# Altium schematic sheet EthernetMagJack.SchDoc
size A
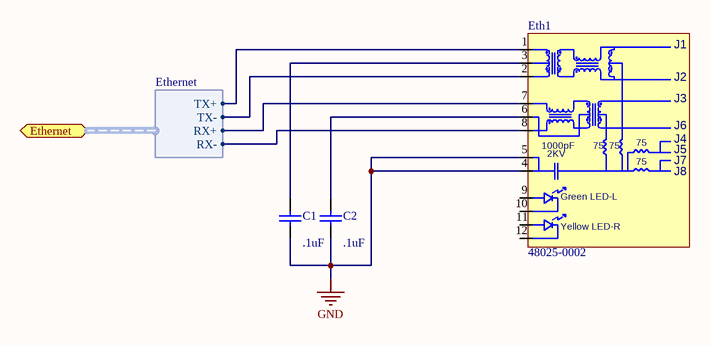
[diagram p0: EthernetMagJack.SchDoc]

## Parts
C1  value .1uF  [0402]  (hidden comment: Cap Semi)
C2  value .1uF  [0402]  (hidden comment: Cap Semi)
Eth1  48025-0002  [48025-0002]

## Ports
Ethernet (harness Ethernet)

## Harnesses
Ethernet: RX-, RX+, TX-, TX+

## Nets
GND: C1.1 C2.1 Eth1.4 Eth1.5
NetC1_2: C1.2 Eth1.3
NetC2_2: C2.2 Eth1.6
NetEth1_1: Eth1.1 ; port Ethernet.TX+
NetEth1_2: Eth1.2 ; port Ethernet.TX-
NetEth1_7: Eth1.7 ; port Ethernet.RX+
NetEth1_8: Eth1.8 ; port Ethernet.RX-

Not connected (* = marked no-connect by the designer): Eth1 9 10 11 12

## Notes on the sheet
- (in symbol 48025-0002) J1; J2; J3; J6; J4; 1000pF; 75; 2KV; J5; J7; J8; Green LED-L; Yellow LED-R

## Library data of the parts
C1 C2 = Cap Semi: Capacitor (Semiconductor SIM Model); Published: 8-Jun-2000; LatestRevisionDate: 17-Jul-2002; LatestRevisionNote: Re-released for DXP Platform.; PackageReference: C1206; Publisher: Altium Limited; Supplier Part Number: 490-1318-1-ND; Supplier: Digi-Key
Eth1 = 48025-0002: Modular RJ45 Jack w/ Magnetics & LEDs; Supplier: Digi-Key; Supplier Part Number: WM5483-ND